# EAGLE design test (EAGLE 6.1)
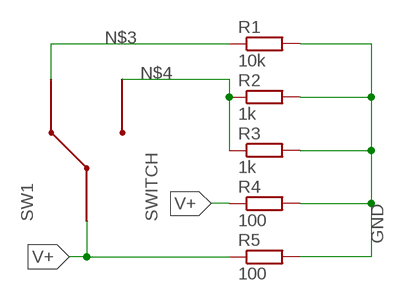
[diagram p0: schematic, sheet 1]

## Parts
R1  10k  R-EU_R3216W  [R3216W]
R2  1k  R-EU_R3216W  [R3216W]
R3  1k  R-EU_R3216W  [R3216W]
R4  100  R-EU_R3216W  [R3216W]
R5  100  R-EU_R3216W  [R3216W]
SW1  SWITCH  [SW3]

## Nets
GND: R1.2 R2.2 R3.2 R4.2 R5.2
N$3: R1.1 SW1.P1
N$4: R2.1 R3.1 SW1.P3
V+: R4.1 R5.1 SW1.P2

## Library data of the parts
R1-R5 = rcl:R-EU_: RESISTOR, European symbol
SW1 = Switch:SWITCH

## Board
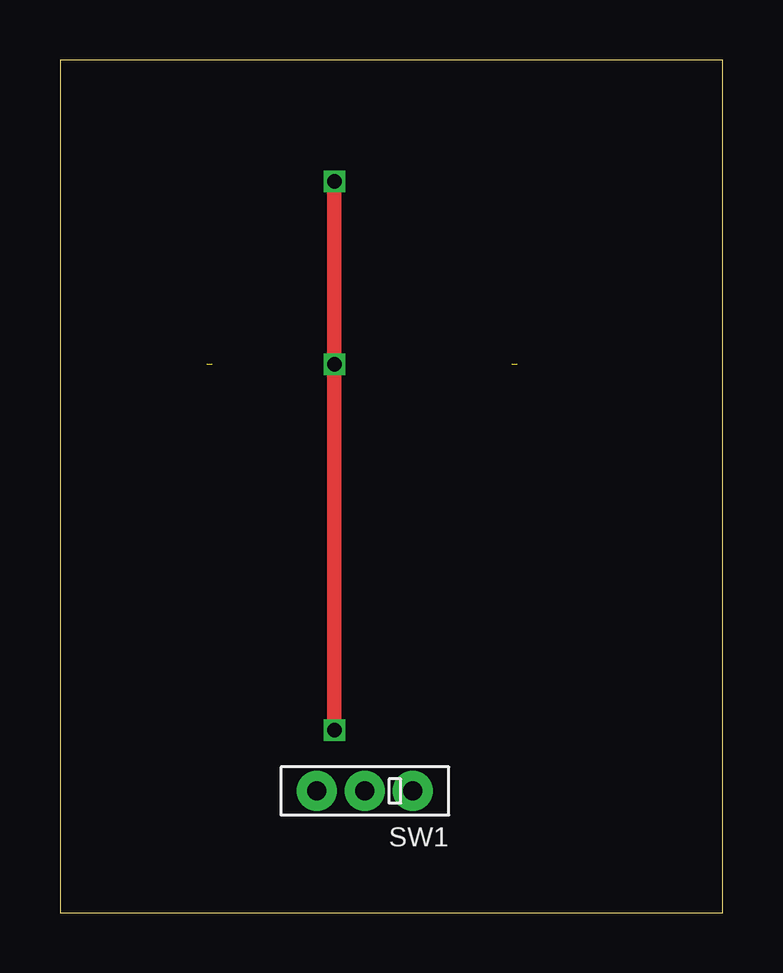
[diagram p1: board, top side]
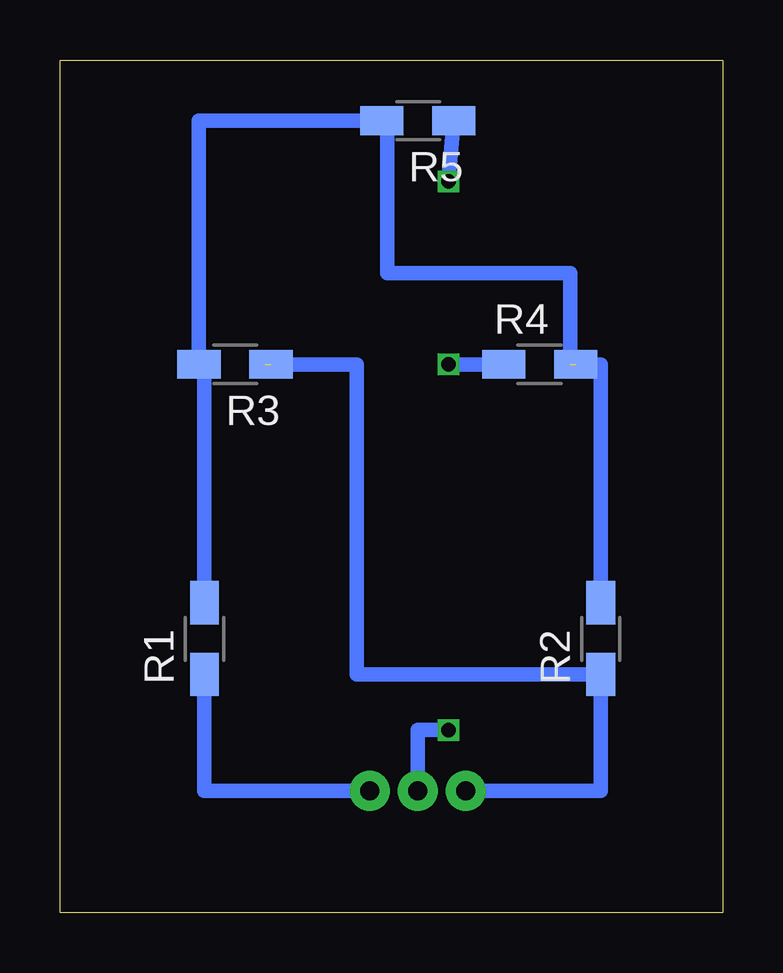
[diagram p2: board, bottom side, seen from below]

Size 27.61 x 35.55 mm. Coordinates in mm from the lower left corner, seen from the top.
Outline: 0,0 27.61,0 27.61,35.55 0,35.55 0,0
Copper layers (1*16): Top 0.035mm / dielectric 1.5mm / Bottom 0.035mm
Design rules: minimum track width 0.15mm, minimum drill 0.3mm, track to track 0.25mm, track to pad 0.25mm, pad to pad 0.25mm, via to via 0.25mm, smd to smd 0.2mm, copper to edge 0.7mm, drill to drill 0.45mm, minimum pad ring 0.15mm, minimum via ring 0.15mm, stop-mask expansion 4mil, vias tented up to drill 0mil, thermal gap 0.15mm

### Footprints (pad centres in the part's own frame; a part is rotated, then mirrored left to right if it is on the bottom)
R3216W = smd 1.8 x 1.2: 1 -1.499,0; 2 1.499,0
SW3 = drill 0.8 pad 1.676: P1 -2,0; P2 0,0; P3 2,0

### Placement (x,y rotation side)
R1  21.59,11.43 90 bottom
R2  5.08,11.43 90 bottom
R3  20.32,22.86 180 bottom
R4  7.62,22.86 0 bottom
R5  12.7,33.02 180 bottom
SW1  12.7,5.08 180 top

### Tracks (layer width: path | path; a pad name or v marks a point on that pad's centre or on a via)
GND  (1 unrouted)
  Bottom 0.61: R2.2 5.08,22.86 R4.2 | R1.2 21.59,22.63 arc-90 R3.2 21.82,33.02 R5.2 13.97,33.02 13.97,26.67 6.35,26.67 6.35,22.86
N$3
  Bottom 0.61: R1.1 21.59,5.08 SW1.P1
N$4  (1 unrouted)
  Bottom 0.61: SW1.P3 5.08,5.08 R2.1 15.24,9.93 15.24,22.86 19.05,22.86
V+  (via drill 0.6)
  Top 0.61: v11.43,30.48 v11.43,22.86 v11.43,7.62
  Bottom 0.61: R5.1 v11.43,30.48 | SW1.P2 12.7,7.62 v11.43,7.62 | R4.1 v11.43,22.86